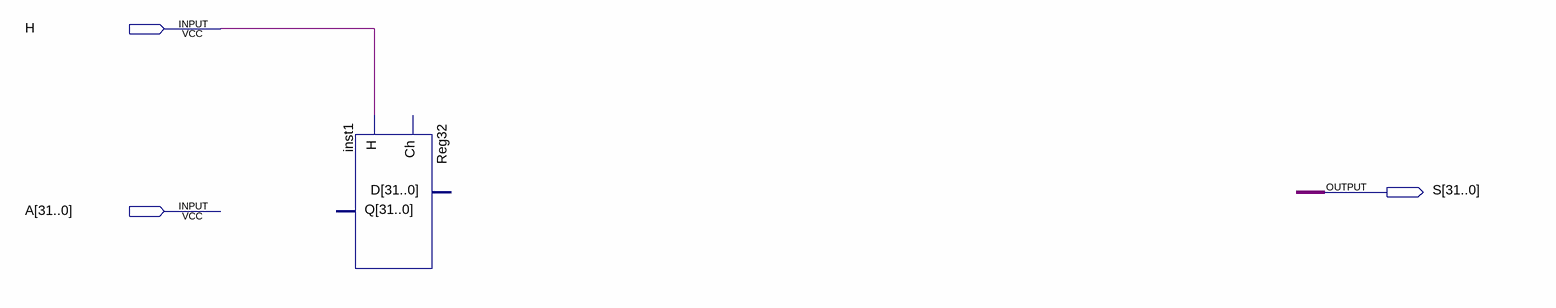
[diagram p0: schematic sheet]
// Quartus schematic 8wordsmemory.bdf as structural Verilog: 1 symbols, 3 pins
module \8wordsmemory  (
  input  H,
  input  [31:0] A,
  output [31:0] S
);

  Reg32 inst1 (.H(H));  // open: D, Ch, Q
endmodule
